# Altium schematic sheet Main.SchDoc: Приемник НТПУ
size 420 x 297 mm; ApprovedBy: Чуриков; Author: Пискунов; CompanyName: АО НПП "ИНТЭЛ"; DocumentNumber: НЛТВ.411183.001; SheetNumber: 1; SheetTotal: 1; GOST_tip_4erteja: Схема электрическая соединений; CurrentDate: 1
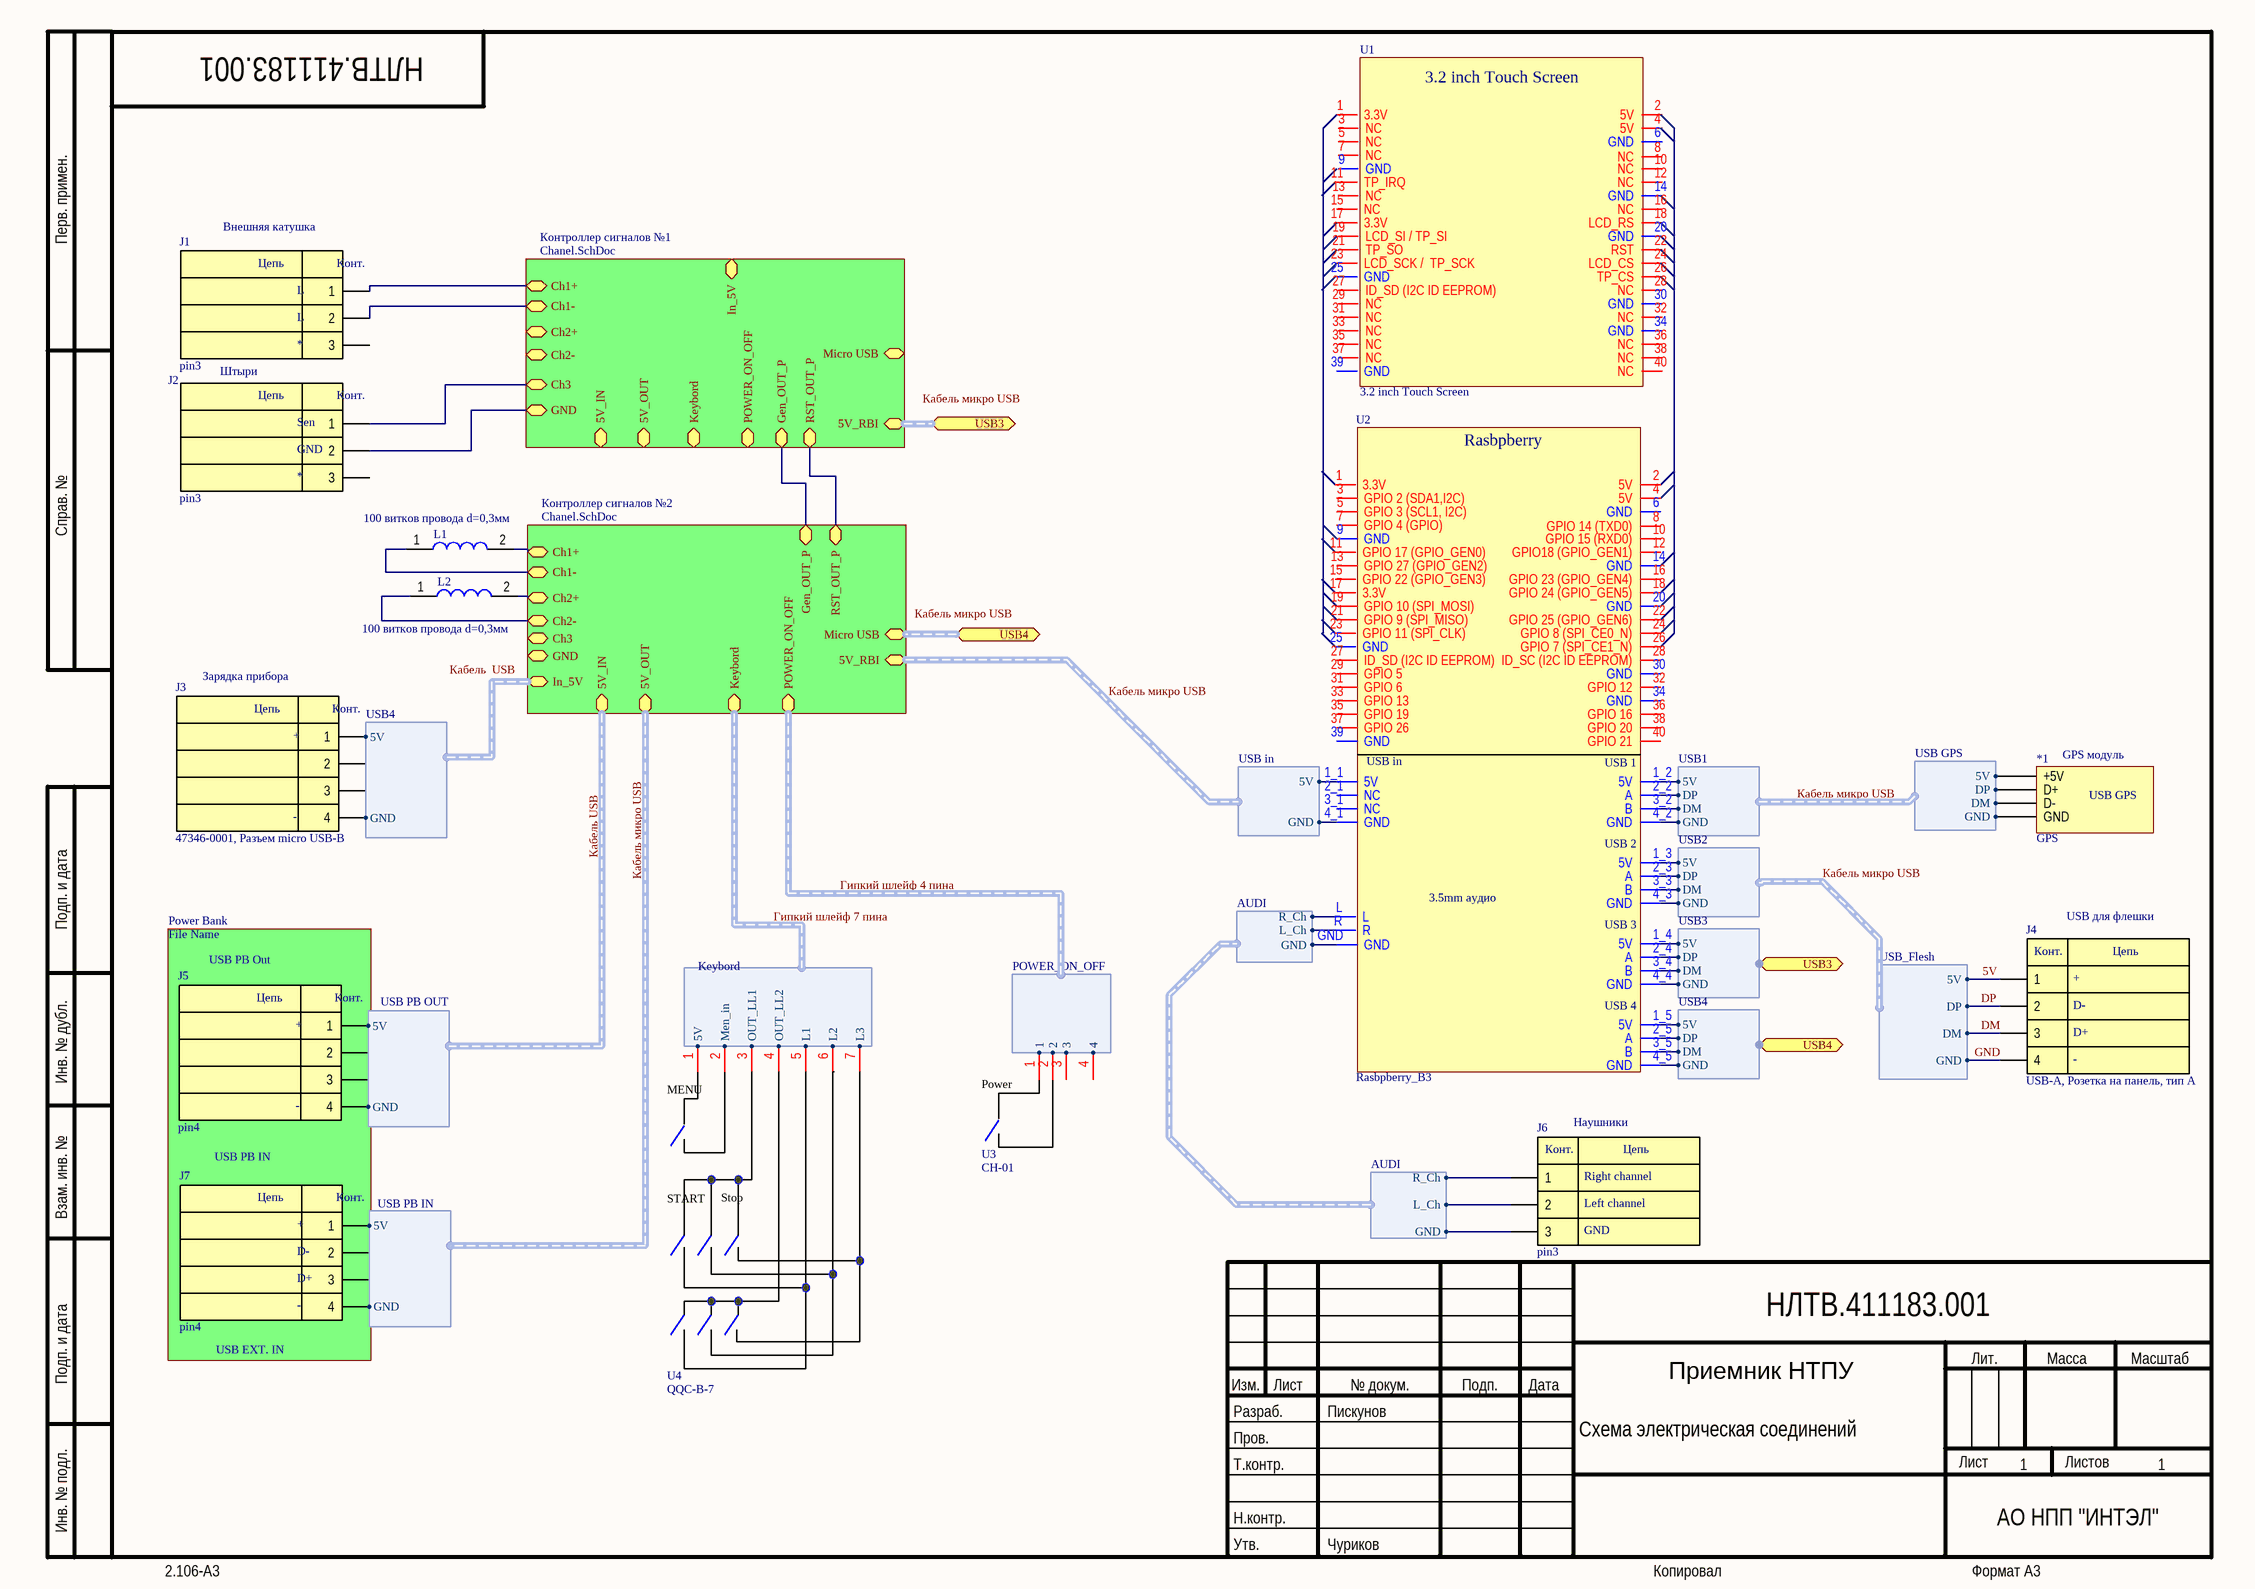
[diagram p0: Main.SchDoc]

## Parts
*1  GPS
J1  pin3  [300-031-12]
J2  pin3  [300-031-12]
J3  47346-0001, Разъем micro USB-B  [MF-4MA]
J4  USB-A, Розетка на панель, тип А  [MF-4MA]
J5  pin4  [MF-4MA]
J6  pin3  [300-031-12]
J7  pin4  [MF-4MA]
L1  100 витков провода d=0,3мм
L2  100 витков провода d=0,3мм
U1  3.2 inch Touch Screen
U2  Rasbpberry_B3
U3  CH-01  [PSOP8]
U4  QQC-B-7  [PSOP8]

## Sub-sheets
Power Bank = File Name: no entries
Контроллер сигналов №1 = Chanel.SchDoc: Micro USB, Ch1+, Ch1-, Ch2+, Ch2-, Ch3, 5V_IN, 5V_OUT, 5V_RBI (harness 5V_RBI), Gen_OUT_P, RST_OUT_P, Keybord (harness Keybord), POWER_ON_OFF (harness POWER_ON_OFF), In_5V, GND
Контроллер сигналов №2 = Chanel.SchDoc: Micro USB, Ch1+, Ch1-, Ch2+, Ch2-, Ch3, 5V_IN (harness USB PB OUT), 5V_OUT (harness USB PB IN), 5V_RBI (harness USB in), Gen_OUT_P, RST_OUT_P, Keybord (harness Keybord), POWER_ON_OFF (harness POWER_ON_OFF), In_5V (harness USB4), GND

## Ports
USB3, USB3 (harness USB3), USB4, USB4 (harness USB4)

## Harnesses
USB_Flesh: 5V, DP, DM, GND
AUDI: R_Ch, L_Ch, GND
Keybord: 5V, Men_in, OUT_LL1, OUT_LL2, L1, L2, L3
POWER_ON_OFF: 1, 2, 3, 4
USB GPS: 5V, DP, DM, GND
USB1: 5V, DP, DM, GND
USB2: 5V, DP, DM, GND
USB3: 5V, DP, DM, GND
USB4: 5V, DP, DM, GND
USB in: 5V, GND
USB PB OUT: 5V, GND
USB PB IN: 5V, GND
USB4: 5V, GND

## Nets
5V: *1.?1(+5V) J4.1 J7.1 U2.1_2(5V) U2.1_3(5V) ; sheet Контроллер сигналов №2/5V_OUT.5V
DM: *1.?3(D-) J4.3 U2.3_2(B) U2.3_3(B) ; sheet Контроллер сигналов №2/5V_OUT.DM
DP: *1.?2(D+) J4.2 U2.2_2(A) U2.2_3(A) ; sheet Контроллер сигналов №2/5V_OUT.DP
GND: *1.?4(GND) J4.4 J7.4 U2.4_2(GND) U2.4_3(GND) ; sheet Контроллер сигналов №2/5V_OUT.GND
Гипкий шлейф 4 пина.1: U3.1 ; sheet Контроллер сигналов №2/POWER_ON_OFF.1
Гипкий шлейф 4 пина.2: U3.2 ; sheet Контроллер сигналов №2/POWER_ON_OFF.2
Гипкий шлейф 4 пина.3: U3.3 ; sheet Контроллер сигналов №2/POWER_ON_OFF.3
Гипкий шлейф 4 пина.4: U3.4 ; sheet Контроллер сигналов №2/POWER_ON_OFF.4
Кабель USB.5V: J5.1 ; sheet Контроллер сигналов №2/5V_IN.5V
Кабель USB.GND: J5.4 ; sheet Контроллер сигналов №2/5V_IN.GND
NetJ1_1: J1.1 ; sheet Контроллер сигналов №1/Ch1+
NetJ1_2: J1.2 ; sheet Контроллер сигналов №1/Ch1-
NetJ2_1: J2.1 ; sheet Контроллер сигналов №1/Ch3
NetJ2_2: J2.2 ; sheet Контроллер сигналов №1/GND
NetJ3_1: J3.1 ; sheet Контроллер сигналов №2/In_5V.5V
NetJ3_4: J3.4 ; sheet Контроллер сигналов №2/In_5V.GND
NetJ6_1: J6.1 U2.L ; harness AUDI.R_Ch
NetJ6_2: J6.2 U2.R ; harness AUDI.L_Ch
NetJ6_3: J6.3 U2.GND ; harness AUDI.GND
NetL1_1: L1.1 ; sheet Контроллер сигналов №2/Ch1-
NetL1_2: L1.2 ; sheet Контроллер сигналов №2/Ch1+
NetL2_1: L2.1 ; sheet Контроллер сигналов №2/Ch2-
NetL2_2: L2.2 ; sheet Контроллер сигналов №2/Ch2+
NetU2_1_1: U2.1_1(5V) ; sheet Контроллер сигналов №2/5V_RBI.5V
NetU2_1_4: U2.1_4(5V) ; port USB3.5V
NetU2_1_5: U2.1_5(5V) ; port USB4.5V
NetU2_2_4: U2.2_4(A) ; port USB3.DP
NetU2_2_5: U2.2_5(A) ; port USB4.DP
NetU2_3_4: U2.3_4(B) ; port USB3.DM
NetU2_3_5: U2.3_5(B) ; port USB4.DM
NetU2_4_1: U2.4_1(GND) ; sheet Контроллер сигналов №2/5V_RBI.GND
NetU2_4_4: U2.4_4(GND) ; port USB3.GND
NetU2_4_5: U2.4_5(GND) ; port USB4.GND
(unnamed): sheet Контроллер сигналов №1/Gen_OUT_P, sheet Контроллер сигналов №2/Gen_OUT_P
(unnamed): sheet Контроллер сигналов №1/RST_OUT_P, sheet Контроллер сигналов №2/RST_OUT_P

Not connected (* = marked no-connect by the designer): J1 3; J2 3; J3 2 3; J5 2 3; J7 2 3; U1 1(3.3V) 2(5V) 3(NC) 4(5V) 5(NC) 6(GND) 7(NC) 8(NC) 9(GND) 10(NC) 11(TP_IRQ) 12(NC) 13(NC) 14(GND) 15(NC) 16(NC) 17(3.3V) 18(LCD_RS) 19(LCD_SI_/_TP_SI) 20(GND) 21(TP_SO) 22(RST) 23(LCD_SCK_/__TP_SCK) 24(LCD_CS) 25(GND) 26(TP_CS) 27(ID_SD_(I2C_ID_EEPROM)) 28(NC) 29(NC) 30(GND) 31(NC) 32(NC) 33(NC) 34(GND) 35(NC) 36(NC) 37(NC) 38(NC) 39(GND) 40(NC); U2 1(3.3V) 2(5V) 2_1(NC) 3(GPIO_2_(SDA1,I2C)) 3_1(NC) 4(5V) 5(GPIO_3_(SCL1,_I2C)) 6(GND) 7(GPIO_4_(GPIO)) 8(GPIO_14_(TXD0)) 9(GND) 10(GPIO_15_(RXD0)) 11(GPIO_17_(GPIO_GEN0)) 12(GPIO18_(GPIO_GEN1)) 13(GPIO_27_(GPIO_GEN2)) 14(GND) 15(GPIO_22_(GPIO_GEN3)) 16(GPIO_23_(GPIO_GEN4)) 17(3.3V) 18(GPIO_24_(GPIO_GEN5)) 19(GPIO_10_(SPI_MOSI)) 20(GND) 21(GPIO_9_(SPI_MISO)) 22(GPIO_25_(GPIO_GEN6)) 23(GPIO_11_(SPI_CLK)) 24(GPIO_8_(SPI_CE0_N)) 25(GND) 26(GPIO_7_(SPI_CE1_N)) 27(ID_SD_(I2C_ID_EEPROM)) 28(ID_SC_(I2C_ID_EEPROM)) 29(GPIO_5) 30(GND) 31(GPIO_6) 32(GPIO_12) 33(GPIO_13) 34(GND) 35(GPIO_19) 36(GPIO_16) 37(GPIO_26) 38(GPIO_20) 39(GND) 40(GPIO_21); U4 1 2 3 4 5 6 7

## Buses and harness runs
harness port USB3 = sheet Контроллер сигналов №1/5V_RBI
harness port USB4 = sheet Контроллер сигналов №2/Micro USB
harness Гипкий шлейф 4 пина = sheet Контроллер сигналов №2/POWER_ON_OFF
harness Гипкий шлейф 7 пина = sheet Контроллер сигналов №2/Keybord
harness Кабель USB = sheet Контроллер сигналов №2/5V_IN
harness Кабель микро USB = sheet Контроллер сигналов №2/5V_OUT

## Notes on the sheet
- Внешняя катушка
- Штыри
- Зарядка прибора
- (near *1) GPS модуль
- USB для флешки
- USB PB Out
- Наушники
- USB PB IN
- USB EXT. IN
- Labels drawn without touching a wire or pin: Кабель  USB, Кабель микро USB
- Перв. примен.
- Справ. №
- Подп. и дата
- Инв. № дубл.
- Взам. инв. №
- Разраб.
- Изм.
- Лист
- № докум.
- Подп.
- Дата
- Лит.
- Масса
- Масштаб
- Пров.
- Т.контр.
- Листов
- Инв. № подл.
- Утв.
- Н.контр.
- 2.106-A3
- Копировал
- Формат А3
- (in symbol CH-01) Power
- (in symbol GPS) USB GPS
- (in symbol pin3) Цепь; Конт.
- (in symbol pin4) Цепь; Конт.
- (in symbol QQC-B-7) MENU; START; Stop
- (in symbol Rasbpberry_B3) Rasbpberry; USB in; USB 1; USB 2; 3.5mm аудио; USB 3; USB 4

## Library data of the parts
J1 = pin3: Name1: L; Name2: L; Name3: *
J2 = pin3: Name1: Sen; Name2: GND; Name3: *
J3 J5 = pin4: Name1: +; Name4: -
J4 J7 = pin4: Name1: +; Name2: D-; Name3: D+; Name4: -
J6 = pin3: Name1: Right channel; Name2: Left channel; Name3: GND
L1 L2 = Inductor_2: Published: 24-Mar-1999; LatestRevisionDate: 17-Jul-2002; LatestRevisionNote: Re-released for DXP Platform.; PackageReference: AXIAL-0.9; Publisher: Altium Limited; PackageDescription: Axial Device, Thru-Hole; 2 Leads; 0.9 in Pin Spacing